# EAGLE design usb-io-boardv7 (EAGLE 7.2.0)
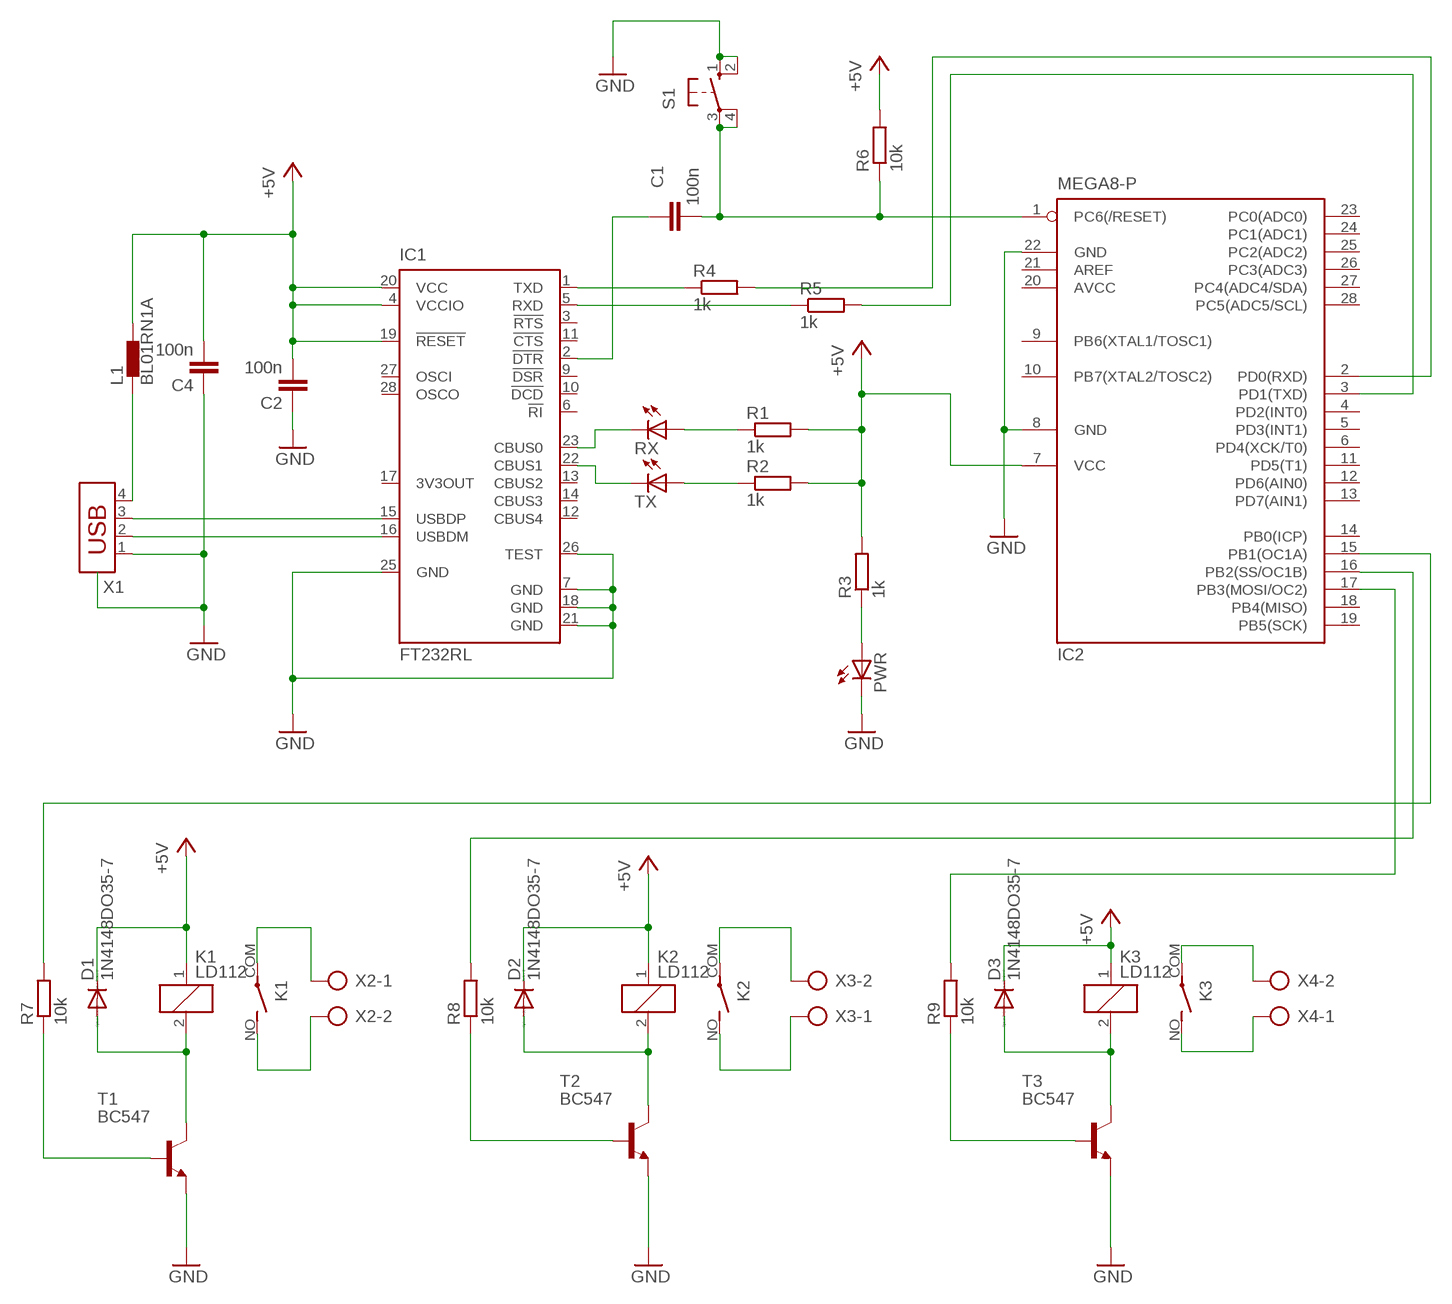
[diagram p0: schematic, sheet 1]

## Parts
C1  100n  C-EU025-024X044  [C025-024X044]
C2  100n  C-EU025-024X044  [C025-024X044]
C4  100n  C-EU025-024X044  [C025-024X044]
D1  1N4148DO35-7  [DO35-7]
D2  1N4148DO35-7  [DO35-7]
D3  1N4148DO35-7  [DO35-7]
IC1  FT232RL  [SSOP28]
IC2  MEGA8-P  [DIL28-3]
K1  LD112  [LD]
K2  LD112  [LD]
K3  LD112  [LD]
L1  BL01RN1A  [BL01RN1A]
PWR  LED5MM  [LED5MM]
R1  1k  R-EU_0204/5  [0204/5]
R2  1k  R-EU_0204/5  [0204/5]
R3  1k  R-EU_0204/5  [0204/5]
R4  1k  R-EU_0204/5  [0204/5]
R5  1k  R-EU_0204/5  [0204/5]
R6  10k  R-EU_0204/5  [0204/5]
R7  10k  R-EU_0204/5  [0204/5]
R8  10k  R-EU_0204/5  [0204/5]
R9  10k  R-EU_0204/5  [0204/5]
RX  LED5MM  [LED5MM]
S1  10-XX  [B3F-10XX]
T1  BC547  [TO92]
T2  BC547  [TO92]
T3  BC547  [TO92]
TX  LED5MM  [LED5MM]
X1  USB-787616  [USB]
X2  AK500/2  [AK500/2]
X3  AK500/2  [AK500/2]
X4  AK500/2  [AK500/2]

## Nets
+5V: C2.2 C4.2 D1.C D2.C D3.C IC1.4(VCCIO) IC1.19(!RESET) IC1.20(VCC) IC2.7(VCC) K1.1 K2.1 K3.1 L1.2 R1.2 R2.2 R3.2 R6.2
GND: C2.1 C4.1 IC1.7(GND) IC1.18(GND) IC1.21(GND) IC1.25(GND) IC1.26(TEST) IC2.8(GND) IC2.22(GND) PWR.K(C) S1.1(S) S1.2(S1) T1.1(E) T2.1(E) T3.1(E) X1.1
N$1: PWR.A R3.1
N$2: IC1.23(CBUS0) RX.K(C)
N$3: IC1.22(CBUS1) TX.K(C)
N$4: R1.1 RX.A
N$5: R2.1 TX.A
N$6: IC1.1(TXD) R4.1
N$7: IC1.5(RXD) R5.1
N$8: C1.1 IC1.2(!DTR)
N$9: C1.2 IC2.1(PC6(/RESET)) R6.1 S1.3(P) S1.4(P1)
N$10: IC2.2(PD0(RXD)) R4.2
N$11: IC2.3(PD1(TXD)) R5.2
N$13: D1.A K1.2 T1.3(C)
N$14: IC1.15(USBDP) X1.3
N$15: IC1.16(USBDM) X1.2
N$16: R7.1 T1.2(B)
N$17: IC2.15(PB1(OC1A)) R7.2
N$18: L1.1 X1.4
N$19: K1.COM(2:P) X2.1
N$20: K1.NO(2:S) X2.2
N$21: IC2.17(PB3(MOSI/OC2)) R9.2
N$22: R8.1 T2.2(B)
N$23: D2.A K2.2 T2.3(C)
N$24: IC2.16(PB2(SS/OC1B)) R8.2
N$25: R9.1 T3.2(B)
N$26: K2.COM(2:P) X3.2
N$27: K2.NO(2:S) X3.1
N$28: D3.A K3.2 T3.3(C)
N$31: K3.COM(2:P) X4.2
N$32: K3.NO(2:S) X4.1
Unconnected: IC1.3(!RTS) IC1.6(!RI) IC1.9(!DSR) IC1.10(!DCD) IC1.11(!CTS) IC1.12(CBUS4) IC1.13(CBUS2) IC1.14(CBUS3) IC1.17(3V3OUT) IC1.27(OSCI) IC1.28(OSCO) IC2.4(PD2(INT0)) IC2.5(PD3(INT1)) IC2.6(PD4(XCK/T0)) IC2.9(PB6(XTAL1/TOSC1)) IC2.10(PB7(XTAL2/TOSC2)) IC2.11(PD5(T1)) IC2.12(PD6(AIN0)) IC2.13(PD7(AIN1)) IC2.14(PB0(ICP)) IC2.18(PB4(MISO)) IC2.19(PB5(SCK)) IC2.21(AREF) IC2.23(PC0(ADC0)) IC2.24(PC1(ADC1)) IC2.25(PC2(ADC2)) IC2.26(PC3(ADC3)) IC2.27(PC4(ADC4/SDA)) IC2.28(PC5(ADC5/SCL))

## Power pins joined to a net without a drawn wire
AVCC: IC2.20(AVCC)

## Library data of the parts
C1 C2 C4 = rcl:C-EU: CAPACITOR, European symbol
D1-D3 = diode:1N4148: DIODE high speed (Philips)
IC1 = ftdichip:FT232R: Source: http://www.ftdichip.com/Documents/DataSheets/DS_FT232R_v104.pdf; MPN: FT232RL; OC_FARNELL: 1146032; OC_NEWARK: 91K9918
IC2 = atmel:MEGA8-P: MICROCONTROLLER 8 Kbytes FLASH, 1 kbytes SRAM, 512 bytes EEPROM, USART, 4-channel 10 bit ADC, 2-channel 8 bit ADC Pin compatible with Atmega48, ATMega88, ATMega168 Source: avr.lbr; OC_FARNELL: unknown; OC_NEWARK: unknown
K1-K3 = relay:LD?*: Slim Power Relay NAiS Source: http://www.mew-europe.com/.. en_ds_61112_0000.pdf; MF: FARNELL; MPN: ALD112; OC_FARNELL: 3727166; OC_NEWARK: 70C6003
L1 = inductors:BL0: Noise Suppression Products/EMI Suppression Filters, Lead EMIFIL(R) Inductor Type Source: http://www.murata.com .. BL01RN1_DS.pdf
PWR RX TX = led:LED: LED OSRAM: - CHIPLED LG R971, LG N971, LY N971, LG Q971, LY Q971, LO R971, LY R971 LH N974, LH R974 LS Q976, LO Q976, LY Q976 LO Q996 - Hyper CHIPLED LW Q18S LB Q993, LB Q99A, LB R99A - SideLED LS A670, LO A670, LY A670, LG A670, LP A670 LB A673, LV A673, LT A673, LW A673 LH A674 LY A675 LS A676, LA A676, LO A676, LY A676, LW A676 LS A679, LY A679, LG A679 - Hyper Micro SIDELED® LS Y876, LA Y876, LO Y876, LY Y876 LT Y87S - SmartLED LW L88C, LW L88S LB L89C, LB L89S, LG L890 LS L89K, LO L89K, LY L89K LS L896, LA L896, LO L896, LY L896 - TOPLED LS T670, LO T670, LY T670, LG T670, LP T670 LSG T670, LSP T670, LSY T670, LOP T670, LYG T670 LG T671, LOG T671, LSG T671 LB T673, LV T673, LT T673, LW T673 LH T674 LS T676, LA T676, LO T676, LY T676, LB T676, LH T676, LSB T676, LW T676 LB T67C, LV T67C, LT T67C, LS T67K, LO T67K, LY T67K, LW E67C LS E67B, LA E67B, LO E67B, LY E67B, LB E67C, LV E67C, LT E67C LW T67C LS T679, LY T679, LG T679 LS T770, LO T770, LY T770, LG T770, LP T770 LB T773, LV T773, LT T773, LW T773 LH T774 LS E675, LA E675, LY E675, LS T675 LS T776, LA T776, LO T776, LY T776, LB T776 LHGB T686 LT T68C, LB T68C - Hyper Mini TOPLED® LB M676 - Mini TOPLED Santana® LG M470 LS M47K, LO M47K, LY M47K Source: http://www.osram.convergy.de LUXEON: - LUMILED® LXK2-PW12-R00, LXK2-PW12-S00, LXK2-PW14-U00, LXK2-PW14-V00 LXK2-PM12-R00, LXK2-PM12-S00, LXK2-PM14-U00 LXK2-PE12-Q00, LXK2-PE12-R00, LXK2-PE12-S00, LXK2-PE14-T00, LXK2-PE14-U00 LXK2-PB12-K00, LXK2-PB12-L00, LXK2-PB12-M00, LXK2-PB14-N00, LXK2-PB14-P00, LXK2-PB14-Q00 LXK2-PR12-L00, LXK2-PR12-M00, LXK2-PR14-Q00, LXK2-PR14-R00 LXK2-PD12-Q00, LXK2-PD12-R00, LXK2-PD12-S00 LXK2-PH12-R00, LXK2-PH12-S00 LXK2-PL12-P00, LXK2-PL12-Q00, LXK2-PL12-R00 Source: www.luxeon.com KINGBRIGHT: KA-3528ASYC Source: www.kingbright.com
R1-R9 = resistor:R-EU_: RESISTOR, European symbol
S1 = switch-omron:10-XX: OMRON SWITCH; MPN: B3F-1000; OC_FARNELL: 176432; OC_NEWARK: 36M3542
T1-T3 = transistor:BC547: NPN TRANSISTOR
X1 = con-amp:USB-787616: AMP connector
X2-X4 = con-ptr500:AK500/2: CONNECTOR; OC_FARNELL: unknown; OC_NEWARK: unknown

## Board
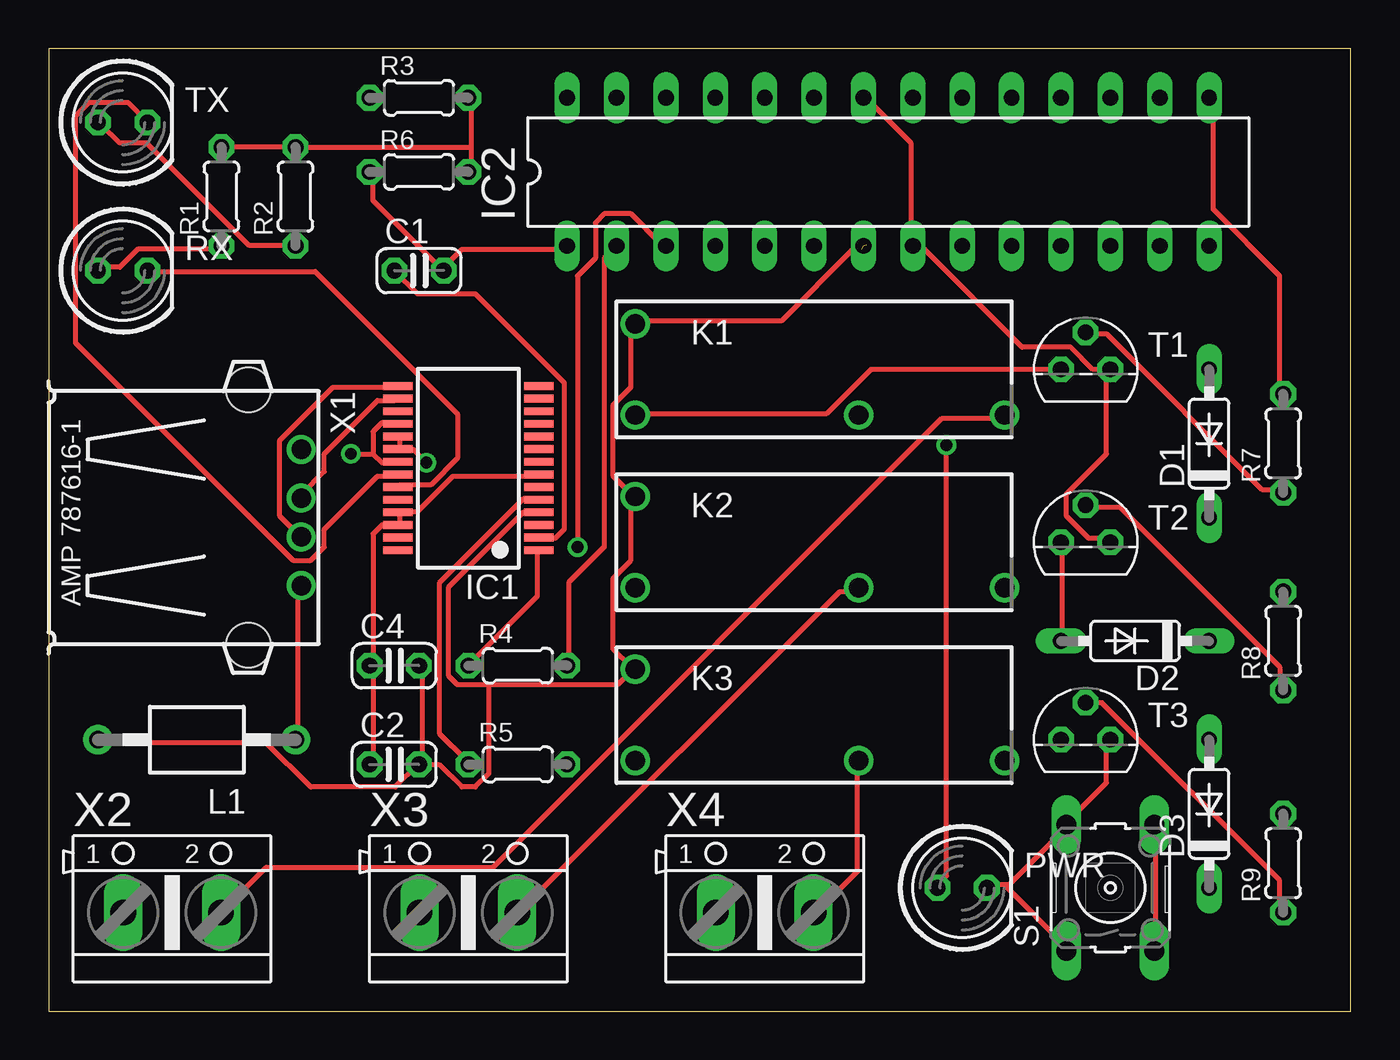
[diagram p1: board, top side]
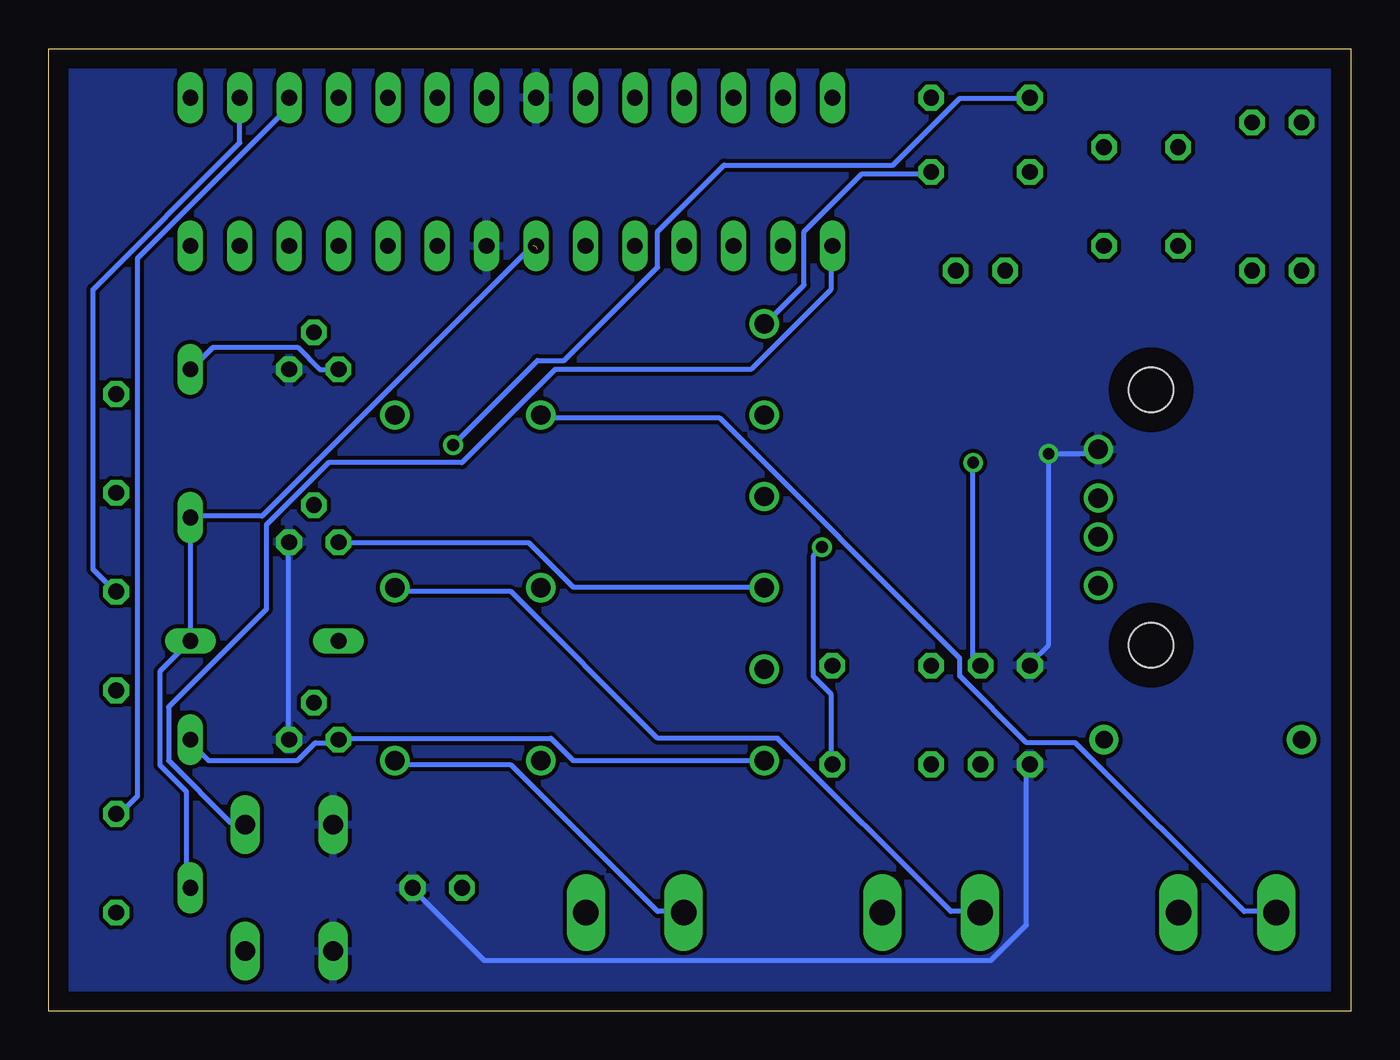
[diagram p2: board, bottom side, seen from below]

Size 66.98 x 49.52 mm. Coordinates in mm from the lower left corner, seen from the top.
Outline: 0,0 66.98,0 66.98,49.52 0,49.52 0,0
Copper layers (1*16): Top 0.035mm / dielectric 1.5mm / Bottom 0.035mm
Design rules "default": minimum track width 10mil, minimum drill 24mil, track to track 8mil, track to pad 8mil, pad to pad 8mil, via to via 8mil, smd to smd 8mil, copper to edge 40mil, drill to drill 8mil, minimum pad ring 10mil, minimum via ring 8mil, stop-mask expansion 4mil, vias tented up to drill 0mil, thermal gap 10mil

### Footprints (pad centres in the part's own frame; a part is rotated, then mirrored left to right if it is on the bottom)
C025-024X044 = drill 0.813 octagon: 1 -1.27,0; 2 1.27,0
DO35-7 = drill 0.813 long: A 3.81,0; C -3.81,0
SSOP28 = smd 0.4 x 1.5: 1 -4.225,-3.625; 2 -3.575,-3.625; 3 -2.925,-3.625; 4 -2.275,-3.625; 5 -1.625,-3.625; 6 -0.975,-3.625; 7 -0.325,-3.625; 8 0.325,-3.625; 9 0.975,-3.625; 10 1.625,-3.625; 11 2.275,-3.625; 12 2.925,-3.625; 13 3.575,-3.625; 14 4.225,-3.625; 15 4.225,3.625; 16 3.575,3.625; 17 2.925,3.625; 18 2.275,3.625; 19 1.625,3.625; 20 0.975,3.625; 21 0.325,3.625; 22 -0.325,3.625; 23 -0.975,3.625; 24 -1.625,3.625; 25 -2.275,3.625; 26 -2.925,3.625; 27 -3.575,3.625; 28 -4.225,3.625
DIL28-3 = drill 0.813 long: 1 -16.51,-3.81; 2 -13.97,-3.81; 3 -11.43,-3.81; 4 -8.89,-3.81; 5 -6.35,-3.81; 6 -3.81,-3.81; 7 -1.27,-3.81; 8 1.27,-3.81; 9 3.81,-3.81; 10 6.35,-3.81; 11 8.89,-3.81; 12 11.43,-3.81; 13 13.97,-3.81; 14 16.51,-3.81; 15 16.51,3.81; 16 13.97,3.81; 17 11.43,3.81; 18 8.89,3.81; 19 6.35,3.81; 20 3.81,3.81; 21 1.27,3.81; 22 -1.27,3.81; 23 -3.81,3.81; 24 -6.35,3.81; 25 -8.89,3.81; 26 -11.43,3.81; 27 -13.97,3.81; 28 -16.51,3.81
LD = drill 1: 1 -9.2,2.35; 2 -9.2,-2.35; COM 2.3,-2.35; NO 9.8,-2.35
BL01RN1A = drill 0.9 pad 1.5: 1 -5.08,0; 2 5.08,0
LED5MM = drill 0.813 octagon: A -1.27,0; K 1.27,0
0204/5 = drill 0.813 octagon: 1 -2.54,0; 2 2.54,0
B3F-10XX = drill 1.016 long: 1 -3.251,2.261; 2 3.251,2.261; 3 -3.251,-2.261; 4 3.251,-2.261
TO92 = drill 0.813 octagon: 1 1.27,0; 2 0,1.905; 3 -1.27,0
USB = drill 1: 1 -3.5,12.99; 2 -1,12.99; 3 1,12.99; 4 3.5,12.99 | hole 2.3: -6.57,10.28; 6.57,10.28
AK500/2 = drill 1.321 long: 1 -2.515,0; 2 2.515,0

### Placement (x,y rotation side)
C1  19.05,38.1 0 top
C2  17.78,12.7 0 top
C4  17.78,17.78 0 top
D1  59.69,29.21 90 top
D2  55.88,19.05 180 top
D3  59.69,10.16 90 top
IC1  21.59,27.94 90 top
IC2  43.18,43.18 0 top
K1  39.37,33.02 0 top
K2  39.37,24.13 0 top
K3  39.37,15.24 0 top
L1  7.62,13.97 180 top
PWR  46.99,6.35 0 top
R1  8.89,41.91 90 top
R2  12.7,41.91 90 top
R3  19.05,46.99 0 top
R4  24.13,17.78 0 top
R5  24.13,12.7 0 top
R6  19.05,43.18 0 top
R7  63.5,29.21 90 top
R8  63.5,19.05 90 top
R9  63.5,7.62 90 top
RX  3.81,38.1 0 top
S1  54.61,6.35 90 top
T1  53.34,33.02 0 top
T2  53.34,24.13 0 top
T3  53.34,13.97 0 top
TX  3.81,45.72 0 top
X1  0,25.4 270 top
X2  6.35,5.08 0 top
X3  21.59,5.08 0 top
X4  36.83,5.08 0 top

### Tracks (layer width: path | path; a pad name or v marks a point on that pad's centre or on a via)
+5V  (via drill 0.61)  (2 unrouted)
  Top 0.254: 18.06,28.9 18.06,29.59 IC1.19 | 18.06,28.9 18.75,28.9 v19.43,28.22 | 18.06,28.9 IC1.20 | C2.2 19.2,12.9 19.2,17.7 C4.2 | L1.2 2.74,13.82 11.2,13.82 13.49,11.53 17.83,11.53 18.97,12.68 C2.2 | 21.72,44.45 21.72,46.97 R3.2 | 21.72,44.45 21.72,43.31 R6.2 | R1.2 R2.2 21.72,44.45 | 41.83,39.19 41.38,39.19 37.72,35.53 30.18,35.53 K1.1 29.95,35.31 29.95,32.11 29.03,31.19 29.03,27.53 29.95,26.62 K2.1 29.95,26.39 29.95,23.19 29.03,22.28 29.03,18.62 29.95,17.7 K3.1 29.95,17.47 29.26,16.79 22.63,16.79 | 22.63,16.79 21.03,16.79 20.57,17.25 20.57,21.82 24.46,25.71 25.15,25.71 IC1.4 | 22.63,16.79 22.63,12.22 21.95,11.53 21.26,11.53 20.12,12.68 19.2,12.68 C2.2
  Bottom 0.254: v19.43,28.22 19.43,18.16 C4.2 | D3.C 59.89,6.5 59.89,11.3 61.27,12.68 61.27,17.47 D2.C 59.66,19.07 59.66,25.25 D1.C 59.66,25.48 56.01,25.48 42.06,39.42 | R6.2 21.72,43.08 25.15,43.08 28.12,40.11 28.12,37.36 29.95,35.53 K1.1
GND  (via drill 0.61)
  Top 0.254: 16.69,28.68 17.14,28.22 17.83,28.22 IC1.21 | 16.69,28.68 16.69,29.82 17.14,30.28 17.83,30.28 IC1.18 | v15.54,28.68 16.69,28.68 | C2.1 16.69,12.9 16.69,17.7 C4.1 16.69,17.93 16.69,24.56 17.14,25.02 17.83,25.02 IC1.26 18.06,25.02 18.06,25.48 IC1.25 18.06,25.71 18.97,25.71 20.8,27.53 25.15,27.53 IC1.7 | IC2.22 42.06,46.97 44.35,44.68 44.35,39.42 IC2.8 44.58,39.19 45.03,39.19 50.06,34.16 52.58,34.16 53.72,33.02 54.41,33.02 | 49.15,6.5 49.38,6.5 52.35,9.47 S1.2 52.35,9.7 54.41,11.76 54.41,13.82 T3.1 | 49.15,6.5 48.46,6.5 PWR.K | 54.41,33.02 54.41,28.68 52.35,26.62 52.35,25.48 53.49,24.33 54.41,24.33 T2.1 | 49.15,6.5 52.35,3.3 S1.1 | 54.41,33.02 T1.1
  Bottom 0.254: X1.1 13.03,28.68 v15.54,28.68 15.54,18.85 16.46,17.93 C4.1 | T2.1 54.63,24.11 54.63,14.05 T3.1 | C2.1 16.69,12.68 16.69,4.45 18.52,2.62 44.58,2.62 48.23,6.27 PWR.K
  pour Bottom: 0,49.53 67.31,49.53 67.31,0 0,0
N$1  (via drill 0.61)
  Top 0.254: v46.18,29.13 46.18,6.96 45.72,6.5 PWR.A
  Bottom 0.254: v46.18,29.13 41.83,33.48 40.46,33.48 35.66,38.28 35.66,40.11 32.23,43.54 23.55,43.54 20.12,46.97 16.69,46.97 R3.1
N$2
  Top 0.254: IC1.23 18.06,27.08 19.66,27.08 21.03,28.45 21.03,30.73 13.72,38.05 5.26,38.05 RX.K
N$3
  Top 0.254: IC1.22 17.83,27.53 16.92,27.53 14.17,24.79 14.17,23.88 13.49,23.19 12.57,23.19 1.37,34.39 1.37,46.05 2.06,46.74 4.12,46.74 5.03,45.82 TX.K
N$4
  Top 0.254: RX.A 2.74,38.28 3.66,38.28 4.57,39.19 8.69,39.19 R1.1
N$5
  Top 0.254: R2.1 12.57,39.42 10.29,39.42 5.03,44.68 3.66,44.68 2.74,45.59 TX.A
N$6
  Top 0.254: IC1.1 25.15,23.65 25.15,21.36 21.72,17.93 R4.1
N$7
  Top 0.254: IC1.5 25.15,26.39 24.46,26.39 20.12,22.05 20.12,14.28 21.49,12.9 R5.1
N$8
  Top 0.254: C1.1 18.97,36.91 21.95,36.91 26.52,32.33 26.52,24.79 26.06,24.33 25.38,24.33 IC1.2
N$9
  Top 0.254: S1.3 56.92,3.3 56.92,9.47 S1.4 | R6.1 16.69,43.08 16.69,41.71 20.12,38.28 C1.2 20.34,38.28 21.26,39.19 26.52,39.19 IC2.1
  Bottom 0.254: S1.4 56.92,9.7 57.61,9.7 60.81,12.9 60.81,15.65 55.78,20.68 55.78,25.02 52.58,28.22 45.72,28.22 40.92,33.02 30.86,33.02 26.75,37.14 26.75,39.19 IC2.1
N$10
  Top 0.254: IC2.2 28.57,38.73 28.57,23.88 26.75,22.05 26.75,17.93 R4.2
N$11  (via drill 0.61)
  Top 0.254: v27.2,23.88 27.2,37.82 28.12,38.73 28.12,40.56 28.57,41.02 29.95,41.02 31.55,39.42 IC2.3
  Bottom 0.254: v27.2,23.88 27.66,23.42 27.66,17.25 26.75,16.33 26.75,12.9 R5.2
N$12
  pour Bottom: 0,49.53 67.31,49.53 67.31,0 0,0
N$13
  Top 0.254: T1.3 42.29,33.02 40.01,30.73 30.18,30.73 K1.2
  Bottom 0.254: T1.3 53.03,33.02 54.18,34.16 58.52,34.16 59.66,33.02 D1.A
N$14
  Top 0.254: IC1.15 17.83,32.11 14.63,32.11 11.89,29.36 11.89,25.48 12.8,24.56 X1.3
N$15
  Top 0.254: IC1.16 17.83,31.42 16.92,31.42 14.17,28.68 14.17,27.76 13.03,26.62 X1.2
N$16
  Top 0.254: R7.1 63.32,26.85 62.41,26.85 54.41,34.85 53.49,34.85 T1.2
N$17
  Top 0.254: IC2.15 59.89,46.97 59.89,41.25 63.32,37.82 63.32,31.88 R7.2
N$18
  Top 0.254: L1.1 12.8,14.05 12.8,21.82 X1.4
N$19
  Bottom 0.254: K1.COM 41.6,30.5 32.46,30.5 20.12,18.16 20.12,17.25 16.69,13.82 14.17,13.82 5.49,5.13 3.89,5.13 X2.1
N$20
  Top 0.254: X2.2 11.2,7.42 22.86,7.42 45.95,30.5 49.15,30.5 K1.NO
N$21
  Bottom 0.254: IC2.17 54.63,46.97 54.63,46.51 62.41,38.73 62.41,11.07 63.32,10.16 R9.2
N$22
  Top 0.254: R8.1 63.32,16.56 63.32,17.7 55.09,25.93 53.49,25.93 T2.2
N$23
  Top 0.254: D2.A 52.12,19.07 52.12,24.11 T2.3
  Bottom 0.254: K2.2 30.18,21.82 40.01,21.82 42.29,24.11 51.89,24.11 T2.3
N$24
  Bottom 0.254: IC2.16 57.15,44.68 64.69,37.14 64.69,22.73 63.55,21.59 R8.2
N$25
  Top 0.254: T3.2 54.18,15.88 63.32,6.73 63.32,5.13 R9.1
N$26
  Top 0.254: K2.COM 41.6,21.59 40.69,21.59 24.23,5.13 X3.2
N$27
  Bottom 0.254: K2.NO 49.15,21.59 43.2,21.59 35.66,14.05 29.49,14.05 20.57,5.13 19.2,5.13 X3.1
N$28
  Bottom 0.254: D3.A 59.66,13.82 58.75,12.9 54.18,12.9 53.26,13.82 52.12,13.82 T3.3 51.89,14.05 41.15,14.05 40.01,12.9 30.18,12.9 K3.2
N$31
  Top 0.254: K3.COM 41.6,12.68 41.6,7.19 39.55,5.13 X4.2
N$32
  Bottom 0.254: K3.NO 49.15,12.68 43.2,12.68 35.66,5.13 34.52,5.13 X4.1